# EAGLE design One-Transistor-FM-Super-Regen (EAGLE 7.2.0)
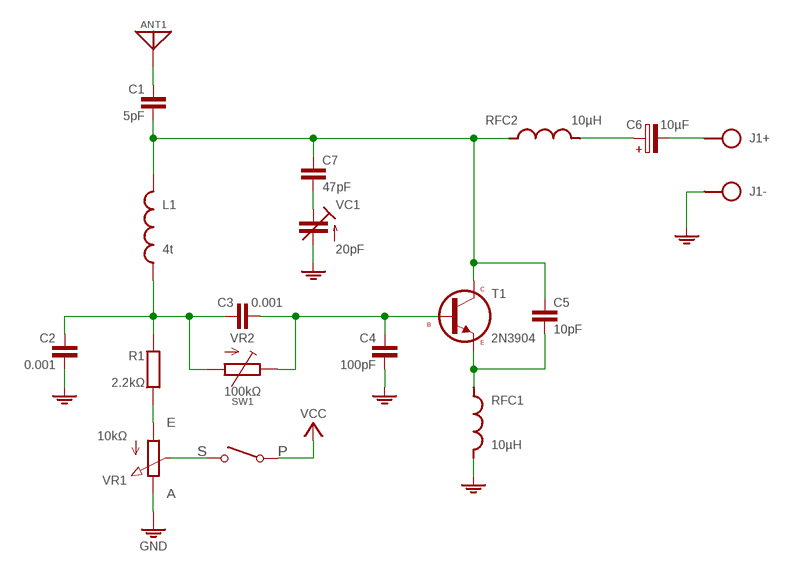
[diagram p0: schematic, sheet 1]

## Parts
ANT1  ANT  [SPAD]
C1  5pF  C025-015X024  [C025-015X024]
C2  0.001  C050-020X036/V  [C050-020X036/V]
C3  0.001  C-H050-020X036  [C050-020X036]
C4  100pF  C050-020X036/V  [C050-020X036/V]
C5  10pF  C050-020X036/V  [C050-020X036/V]
C6  10µF  CPOL-HE2,5-4  [E2,5-4]
C7  47pF  C025-015X024  [C025-015X024]
J1  SPAD+-+-  [SPAD+-]
L1  4t  L04/7-V  [L-04/7-V]
R1  2.2kΩ  R0204/10-V  [0204/10-V]
RFC1  10µH  L-SHORT04-2/5V  [L-04-2/5V]
RFC2  10µH  L-H-SHORT-03/10  [L-03/10]
S6  VCC_GNDPWR-R  [PWR-R]
SW1  SW-SPST-SL-1P2T-H  [SLSW-1P2T-H]
T1  2N3904  [TO92]
VC1  20pF  C-TR-PH20127  [TRIM-2222-808]
VR1  10kΩ  POT-TRIM  [TRIM-POT]
VR2  100kΩ  TRIM-2-TR-3TO2  [TRIM-POT]

## Nets
GND: C2.2 C4.2 J1.1 RFC1.1 S6.1 VC1.1(A) VC1.3(A) VR1.E
N$1: ANT1.1 C1.1
N$2: C1.2 C5.1 C7.1 L1.1 RFC2.2 T1.3(C)
N$3: C2.1 C3.1 L1.2 R1.1 VR2.E VR2.S
N$4: C7.2 VC1.2(E)
N$5: R1.2 VR1.A
N$6: C5.2 RFC1.2 T1.1(E)
N$7: C3.2 C4.1 T1.2(B) VR2.A
N$8: SW1.S VR1.S
N$9: C6.+ RFC2.1
N$10: C6.- J1.2
VCC: S6.2 SW1.P

## Library data of the parts
ANT1 = pad:ANT
C1 C2 C4 C5 C7 = c:C: CAPACITOR, European symbol
C3 = c:C-H
C6 = c:CPOL-H
J1 = pad:SPAD+-
L1 = l:L: Potentiometers Beckman, Copal, Piher, Spectrol, Schukat Created by librarian@cadsoft.de
R1 = r:R: RESISTOR, European symbol
RFC1 = l:L-SHORT
RFC2 = l:L-H-SHORT
S6 = pad:VCC_GND
SW1 = sw:SW-SPST
T1 = t:2N3904
VC1 = cap-trim:C-TR-PH20127
VR1 = r:POT
VR2 = r:TRIM-2

## Board
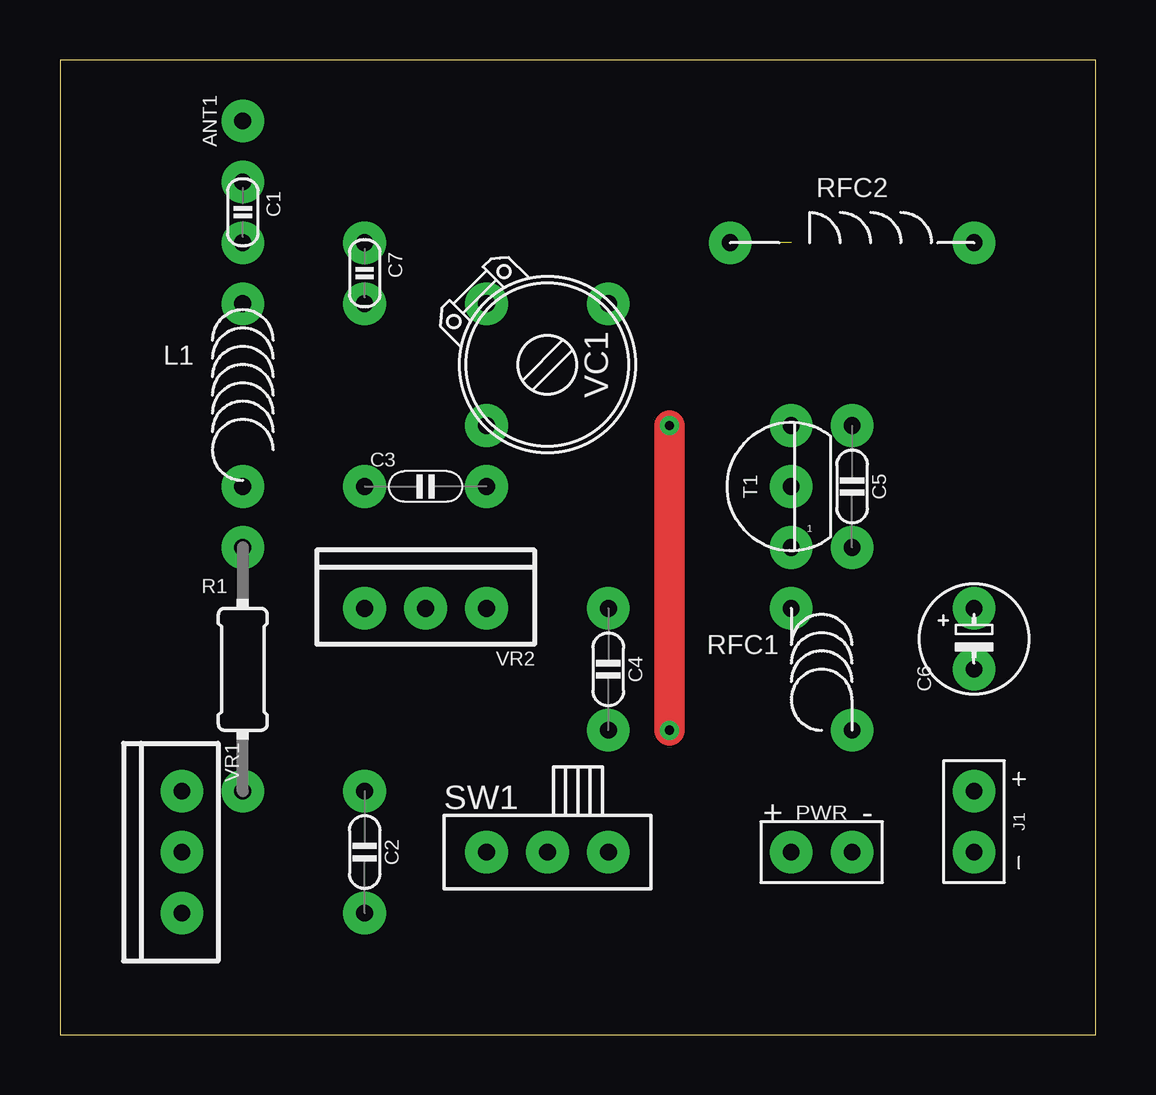
[diagram p1: board, top side]
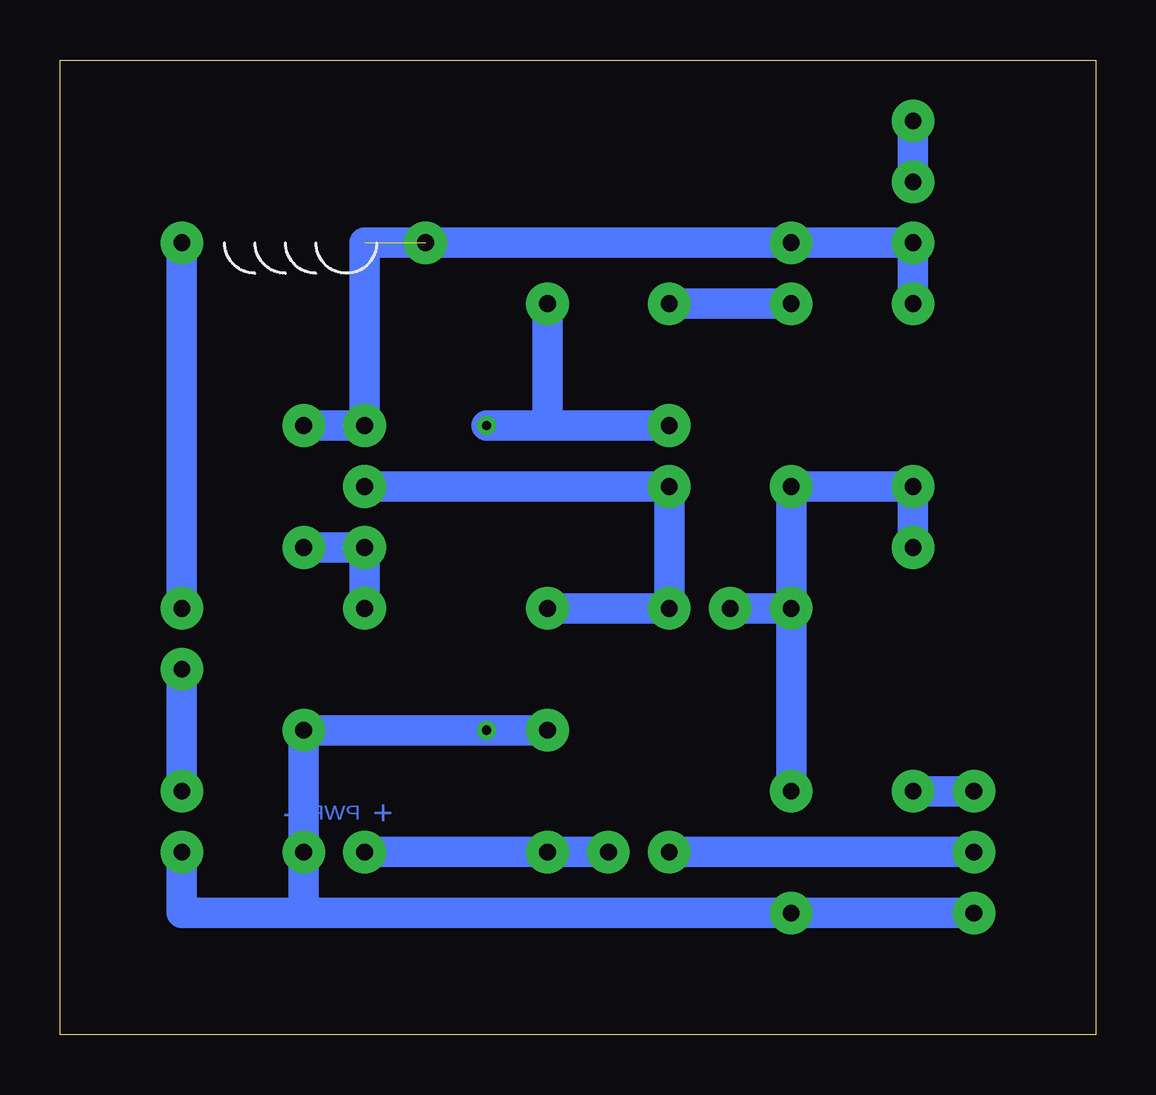
[diagram p2: board, bottom side, seen from below]

Size 43.18 x 40.64 mm. Coordinates in mm from the lower left corner, seen from the top.
Outline: 0,0 43.18,0 43.18,40.64 0,40.64 0,0
Copper layers (1*16): Top 0.035mm / dielectric 1.5mm / Bottom 0.035mm
Design rules "default": minimum track width 10mil, minimum drill 24mil, track to track 8mil, track to pad 8mil, pad to pad 8mil, via to via 8mil, smd to smd 8mil, copper to edge 40mil, drill to drill 8mil, minimum pad ring 10mil, minimum via ring 8mil, stop-mask expansion 4mil, vias tented up to drill 0mil, thermal gap 10mil

### Footprints (pad centres in the part's own frame; a part is rotated, then mirrored left to right if it is on the bottom)
SPAD = drill 0.7 pad 1.778: 1 0,0
C025-015X024 = drill 0.7 pad 1.778: 1 -1.27,0; 2 1.27,0
C050-020X036/V = drill 0.7 pad 1.778: 1 0,-2.54; 2 0,2.54
C050-020X036 = drill 0.7 pad 1.778: 1 -2.54,0; 2 2.54,0
E2,5-4 = drill 0.7 pad 1.778: + 1.27,0; - -1.27,0
SPAD+- = drill 0.7 pad 1.778: 1 0,-1.27; 2 0,1.27
L-04/7-V = drill 0.7 pad 1.778: 1 0,3.81; 2 0,-3.81
0204/10-V = drill 0.7 pad 1.778: 1 0,5.08; 2 0,-5.08
L-04-2/5V = drill 0.7 pad 1.778: 1 1.27,-2.54; 2 -1.27,2.54
L-03/10 = drill 0.7 pad 1.778: 1 5.08,0; 2 -5.08,0
PWR-R = drill 0.7 pad 1.778: 1 0,-1.27; 2 0,1.27
SLSW-1P2T-H = drill 0.7 pad 1.778: O 2.54,0; P 0,0; S -2.54,0
TO92 = drill 0.7 pad 1.778: 1 0,2.54; 2 0,0; 3 0,-2.54
TRIM-2222-808 = drill 0.7 pad 1.778: 1 -2.54,2.54; 2 -2.54,-2.54; 3 2.54,-2.54
TRIM-POT = drill 0.7 pad 1.778: A -2.54,0; E 2.54,0; S 0,0

### Placement (x,y rotation side)
ANT1  7.62,38.1 0 top
C1  7.62,34.29 270 top
C2  12.7,7.62 180 top
C3  15.24,22.86 0 top
C4  22.86,15.24 180 top
C5  33.02,22.86 180 top
C6  38.1,16.51 90 top
C7  12.7,31.75 270 top
J1  38.1,8.89 0 top
L1  7.62,26.67 0 top
R1  2.2kΩ  [0204/10-V]  7.62,15.24 0 top
RFC1  31.75,15.24 0 top
RFC2  33.02,33.02 0 top
S6  31.75,7.62 90 top
SW1  20.32,7.62 0 top
T1  30.48,22.86 180 top
VC1  20.32,27.94 270 top
VR1  10kΩ  [TRIM-POT]  5.08,7.62 270 top
VR2  100kΩ  [TRIM-POT]  15.24,17.78 180 top

### Tracks (layer width: path | path; a pad name or v marks a point on that pad's centre or on a via)
GND  (via drill 0.38)
  Top 1.27: v25.4,12.7 v25.4,25.4
  Bottom 1.27: VR1.E C2.2 33.02,5.08 | 33.02,5.08 S6.1 RFC1.1 v25.4,12.7 | v25.4,12.7 | C4.2 v25.4,12.7 | v25.4,25.4 22.86,25.4 | VC1.3 22.86,25.4 | 22.86,25.4 VC1.1 | 33.02,5.08 38.1,5.08 J1.1
N$1
  Bottom 1.27: C1.1 ANT1.1
N$2  (1 unrouted)
  Bottom 1.27: C5.1 T1.3 30.48,33.02 C7.1 C1.2 L1.1
N$3
  Bottom 1.27: VR2.S VR2.E | VR2.E C3.1 L1.2 R1.1 | C2.1 VR2.E
N$4
  Bottom 1.27: C7.2 VC1.2
N$5
  Bottom 1.27: R1.2 VR1.A
N$6
  Bottom 1.27: RFC1.2 T1.1 C5.2
N$7
  Bottom 1.27: T1.2 C3.2 17.78,19.05 VR2.A C4.1
N$8
  Bottom 1.27: SW1.S VR1.S
N$9
  Bottom 1.27: RFC2.1 C6.+
N$10
  Bottom 1.27: J1.2 C6.-
VCC
  Bottom 1.27: S6.2 SW1.P